# EAGLE design pm10Control (EAGLE 9.6.2)

## Sheet 1 of 2
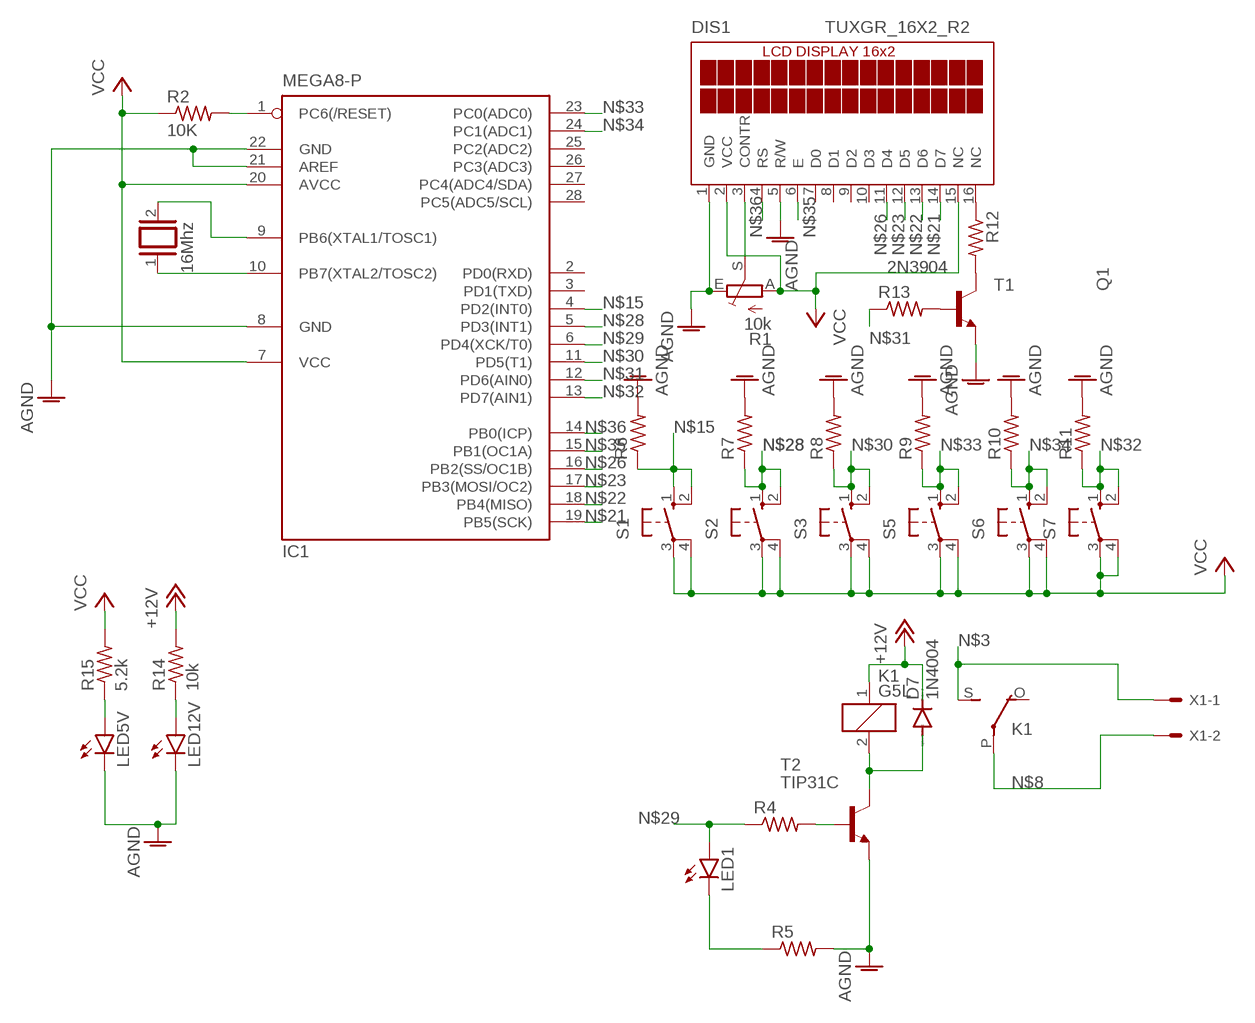
[diagram p0: schematic, sheet 1]

### Parts
D7  1N4004  [DO41-10]
DIS1  TUXGR_16X2_R2  [TUXGR_16X2_R2]
IC1  MEGA8-P  [DIL28-3]
K1  G5L  [G5LE]
LED1  LED3MM  [LED3MM]
LED5V  LED3MM  [LED3MM]
LED12V  LED3MM  [LED3MM]
Q1  16Mhz  XTAL/S  [QS]
R1  10k  TRIM_EU-B64Y  [B64Y]
R2  10K  R-US_0207/10  [0207/10]
R4  R-US_0207/10  [0207/10]
R5  R-US_0207/10  [0207/10]
R6  R-US_0207/10  [0207/10]
R7  R-US_0207/10  [0207/10]
R8  R-US_0207/10  [0207/10]
R9  R-US_0207/10  [0207/10]
R10  R-US_0207/10  [0207/10]
R11  R-US_0207/10  [0207/10]
R12  R-US_0207/10  [0207/10]
R13  R-US_0207/10  [0207/10]
R14  10k  R-US_0207/10  [0207/10]
R15  5.2k  R-US_0207/10  [0207/10]
S1  10-XX  [B3F-10XX]
S2  10-XX  [B3F-10XX]
S3  10-XX  [B3F-10XX]
S5  10-XX  [B3F-10XX]
S6  10-XX  [B3F-10XX]
S7  10-XX  [B3F-10XX]
T1  2N3904  [TO92]
T2  TIP31C  [TO220]
X1  KK-156-2  [KK-156-2]

### Nets
+12V: D7.C K1.1 R14.2 ; also sheet 2
AGND: DIS1.1(GND) DIS1.5(R/W) IC1.8(GND) IC1.21(AREF) IC1.22(GND) LED5V.K(C) LED12V.K(C) R1.E R5.2 R6.2 R7.2 R8.2 R9.2 R10.2 R11.2 T1.3(E) T2.3(E) ; also sheet 2
N$1: IC1.9(PB6(XTAL1/TOSC1)) Q1.2
N$2: IC1.10(PB7(XTAL2/TOSC2)) Q1.1
N$3: K1.S(2:S) X1.1
N$4: DIS1.16(NC) R12.1
N$5: R12.2 T1.1(C)
N$6: R13.2 T1.2(B)
N$7: IC1.1(PC6(/RESET)) R2.2
N$8: K1.P(2:P) X1.2
N$9: DIS1.3(CONTR) R1.S
N$11: LED5V.A R15.1
N$13: LED12V.A R14.1
N$15: IC1.4(PD2(INT0)) R6.1 S1.1(S) S1.2(S1)
N$21: DIS1.14(D7) IC1.19(PB5(SCK))
N$22: DIS1.13(D6) IC1.18(PB4(MISO))
N$23: DIS1.12(D5) IC1.17(PB3(MOSI/OC2))
N$24: D7.A K1.2 T2.2(C)
N$25: R4.2 T2.1(B)
N$26: DIS1.11(D4) IC1.16(PB2(SS/OC1B))
N$27: LED1.K(C) R5.1
N$28: IC1.5(PD3(INT1)) R7.1 S2.1(S) S2.2(S1)
N$29: IC1.6(PD4(XCK/T0)) LED1.A R4.1
N$30: IC1.11(PD5(T1)) R8.1 S3.1(S) S3.2(S1)
N$31: IC1.12(PD6(AIN0)) R13.1
N$32: IC1.13(PD7(AIN1)) R11.1 S7.1(S) S7.2(S1)
N$33: IC1.23(PC0(ADC0)) R9.1 S5.1(S) S5.2(S1)
N$34: IC1.24(PC1(ADC1)) R10.1 S6.1(S) S6.2(S1)
N$35: DIS1.6(E) IC1.15(PB1(OC1A))
N$36: DIS1.4(RS) IC1.14(PB0(ICP))
VCC: DIS1.2(VCC) DIS1.15(NC) IC1.7(VCC) IC1.20(AVCC) R1.A R2.1 R15.2 S1.3(P) S1.4(P1) S2.3(P) S2.4(P1) S3.3(P) S3.4(P1) S5.3(P) S5.4(P1) S6.3(P) S6.4(P1) S7.3(P) S7.4(P1) ; also sheet 2
Unconnected: DIS1.7(D0) DIS1.8(D1) DIS1.9(D2) DIS1.10(D3) IC1.2(PD0(RXD)) IC1.3(PD1(TXD)) IC1.25(PC2(ADC2)) IC1.26(PC3(ADC3)) IC1.27(PC4(ADC4/SDA)) IC1.28(PC5(ADC5/SCL)) K1.O(2:O)

## Sheet 2 of 2
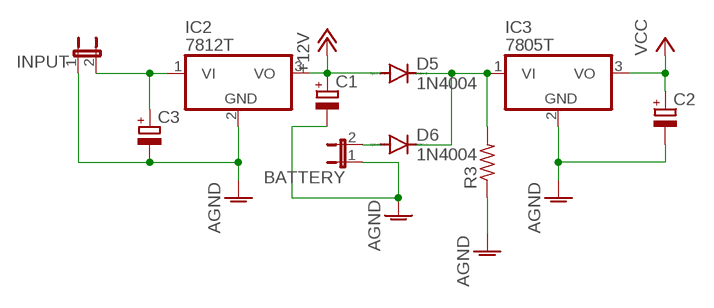
[diagram p1: schematic, sheet 2]

### Parts
BATTERY  JP1E  [JP1]
C1  CPOL-EUE5-10.5  [E5-10,5]
C2  CPOL-EUE5-10.5  [E5-10,5]
C3  CPOL-EUE5-10.5  [E5-10,5]
D5  1N4004  [DO41-10]
D6  1N4004  [DO41-10]
IC2  7812T  [TO220H]
IC3  7805T  [TO220H]
INPUT  JP1E  [JP1]
R3  R-US_0207/10  [0207/10]

### Nets
+12V: C1.+ D5.A IC2.3(VO) ; also sheet 1
AGND: BATTERY.1 C1.- C2.- C3.- IC2.2(GND) IC3.2(GND) INPUT.1 R3.1 ; also sheet 1
N$10: D5.C D6.C IC3.1(VI) R3.2
N$12: BATTERY.2 D6.A
N$16: C3.+ IC2.1(VI) INPUT.2
VCC: C2.+ IC3.3(VO) ; also sheet 1

## Library data of the parts
BATTERY INPUT = jumper:JP1E: JUMPER
C1-C3 = rcl:CPOL-EU: POLARIZED CAPACITOR, European symbol; SPICEPREFIX: C
D5-D7 = diode:1N4004: DIODE general purpose rectifier, 1 A
DIS1 = display-lcd:TUXGR_16X2_R2: Tuxgraphics LCD display 16x2 characters reflective, without background light Source: tuxgr_12x2_r2.pdf; OC_FARNELL: unknown; OC_NEWARK: unknown
IC1 = atmel:MEGA8-P: MICROCONTROLLER 8 Kbytes FLASH, 1 kbytes SRAM, 512 bytes EEPROM, USART, 4-channel 10 bit ADC, 2-channel 8 bit ADC Pin compatible with Atmega48, ATMega88, ATMega168 Source: avr.lbr; OC_FARNELL: unknown; OC_NEWARK: unknown
IC2 IC3 = linear:78*: Positive VOLTAGE REGULATOR Source: http://cache.national.com/ds/LM/LM78L05.pdf http://www.fairchildsemi.com/ds/LM/LM7805.pdf
K1 = relay:G5L: RELAY 1 x switch, 10 A/120 V AC, 8 A/30 V ADC, Omron; OC_FARNELL: unknown; OC_NEWARK: unknown
LED1 LED5V LED12V = led:LED: LED OSRAM: - CHIPLED LG R971, LG N971, LY N971, LG Q971, LY Q971, LO R971, LY R971 LH N974, LH R974 LS Q976, LO Q976, LY Q976 LO Q996 - Hyper CHIPLED LW Q18S LB Q993, LB Q99A, LB R99A - SideLED LS A670, LO A670, LY A670, LG A670, LP A670 LB A673, LV A673, LT A673, LW A673 LH A674 LY A675 LS A676, LA A676, LO A676, LY A676, LW A676 LS A679, LY A679, LG A679 - Hyper Micro SIDELED® LS Y876, LA Y876, LO Y876, LY Y876 LT Y87S - SmartLED LW L88C, LW L88S LB L89C, LB L89S, LG L890 LS L89K, LO L89K, LY L89K LS L896, LA L896, LO L896, LY L896 - TOPLED LS T670, LO T670, LY T670, LG T670, LP T670 LSG T670, LSP T670, LSY T670, LOP T670, LYG T670 LG T671, LOG T671, LSG T671 LB T673, LV T673, LT T673, LW T673 LH T674 LS T676, LA T676, LO T676, LY T676, LB T676, LH T676, LSB T676, LW T676 LB T67C, LV T67C, LT T67C, LS T67K, LO T67K, LY T67K, LW E67C LS E67B, LA E67B, LO E67B, LY E67B, LB E67C, LV E67C, LT E67C LW T67C LS T679, LY T679, LG T679 LS T770, LO T770, LY T770, LG T770, LP T770 LB T773, LV T773, LT T773, LW T773 LH T774 LS E675, LA E675, LY E675, LS T675 LS T776, LA T776, LO T776, LY T776, LB T776 LHGB T686 LT T68C, LB T68C - Hyper Mini TOPLED® LB M676 - Mini TOPLED Santana® LG M470 LS M47K, LO M47K, LY M47K Source: http://www.osram.convergy.de LUXEON: - LUMILED® LXK2-PW12-R00, LXK2-PW12-S00, LXK2-PW14-U00, LXK2-PW14-V00 LXK2-PM12-R00, LXK2-PM12-S00, LXK2-PM14-U00 LXK2-PE12-Q00, LXK2-PE12-R00, LXK2-PE12-S00, LXK2-PE14-T00, LXK2-PE14-U00 LXK2-PB12-K00, LXK2-PB12-L00, LXK2-PB12-M00, LXK2-PB14-N00, LXK2-PB14-P00, LXK2-PB14-Q00 LXK2-PR12-L00, LXK2-PR12-M00, LXK2-PR14-Q00, LXK2-PR14-R00 LXK2-PD12-Q00, LXK2-PD12-R00, LXK2-PD12-S00 LXK2-PH12-R00, LXK2-PH12-S00 LXK2-PL12-P00, LXK2-PL12-Q00, LXK2-PL12-R00 Source: www.luxeon.com KINGBRIGHT: KA-3528ASYC Source: www.kingbright.com
Q1 = special:XTAL/S: CRYSTAL
R1 = pot:TRIM_EU-: POTENTIOMETER
R2-R15 = rcl:R-US_: RESISTOR, American symbol; SPICEPREFIX: R
S1-S3 S5-S7 = switch-omron:10-XX: OMRON SWITCH; MPN: B3F-1000; OC_FARNELL: 176432; OC_NEWARK: 36M3542
T1 = transistor:2N3904: NPN TRANSISTOR
T2 = transistor-neu-to92:TIP31C: NPN TRANSISTOR
X1 = con-molex:KK-156-2: KK 156 HEADER Source: http://www.molex.com/pdm_docs/sd/026604100_sd.pdf; MF: MOLEX; OC_FARNELL: unknown; OC_NEWARK: unknown

## Board
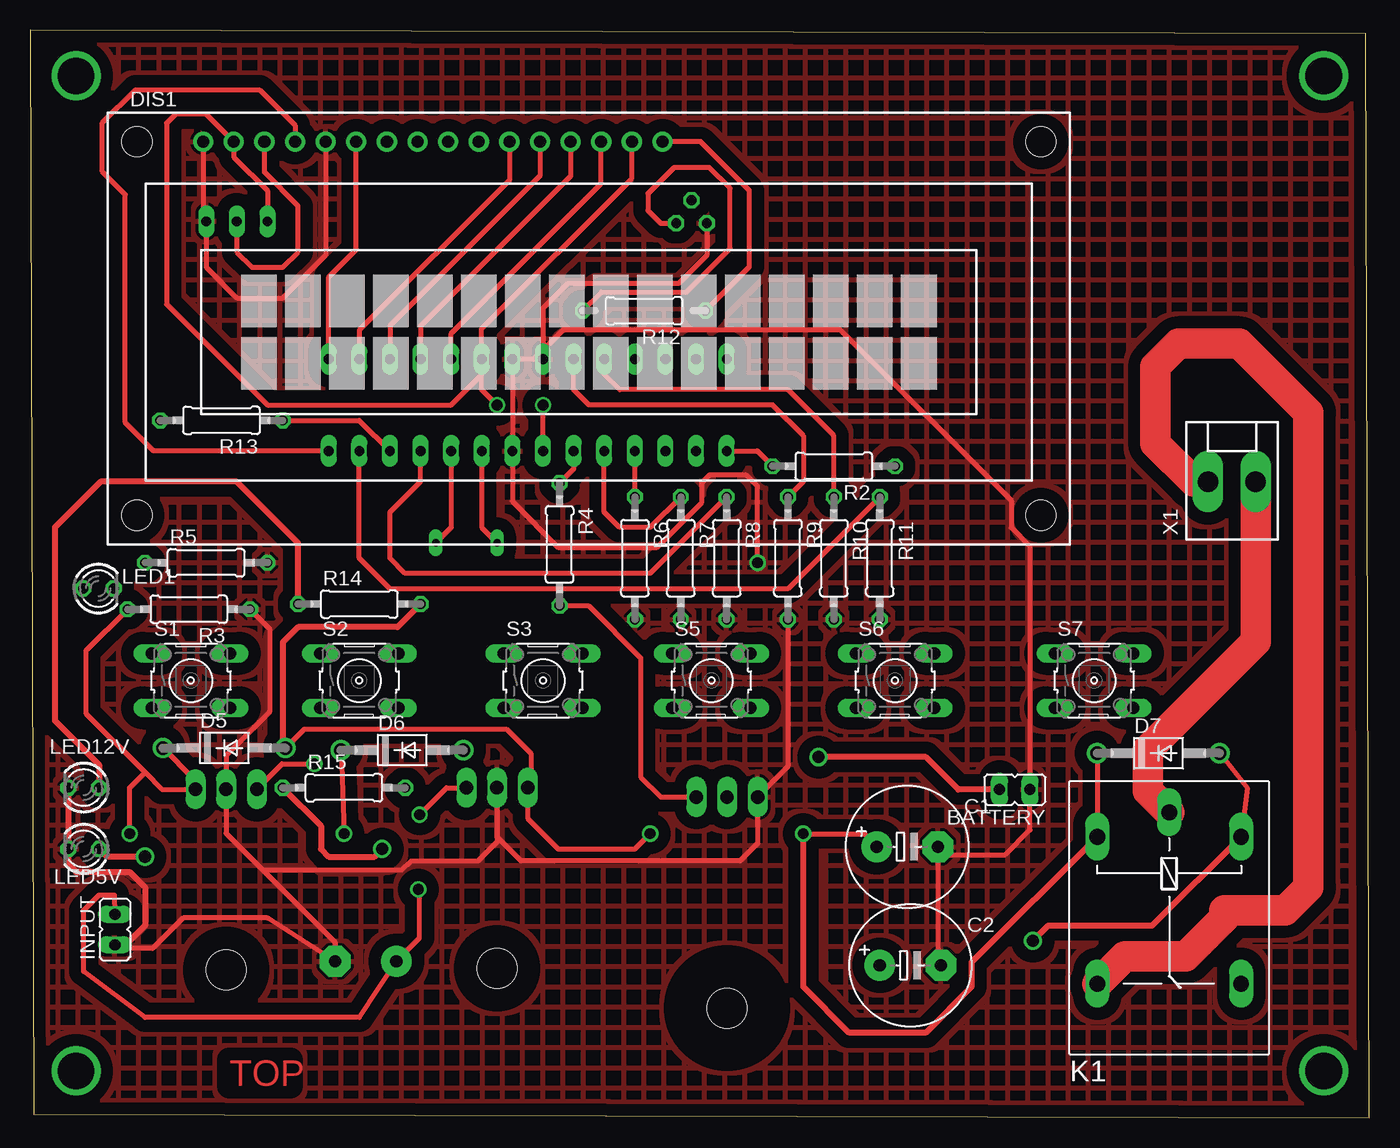
[diagram p2: board, top side]
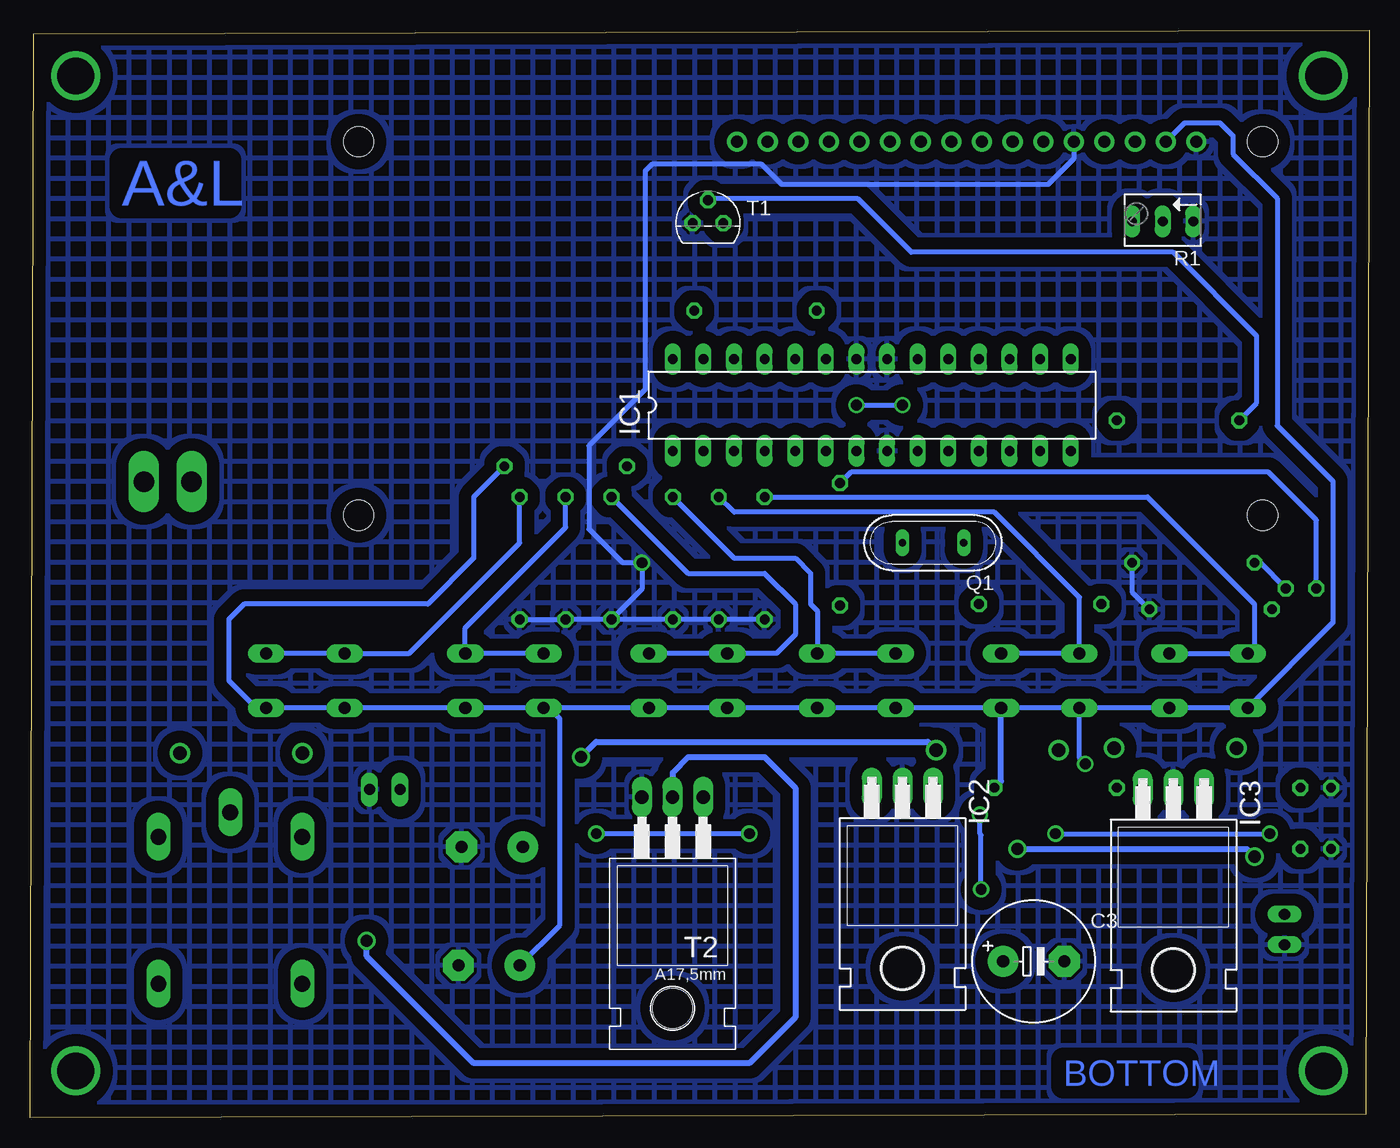
[diagram p3: board, bottom side, seen from below]

Size 111.1 x 90.24 mm. Coordinates in mm from the lower left corner, seen from the top.
Outline: 0.3,0.28 111.1,0 110.8,89.96 0,90.24 0.3,0.28
Copper layers (1*16): Top 0.035mm / dielectric 1.5mm / Bottom 0.035mm
Design rules "default": minimum track width 6mil, minimum drill 0.35mm, track to track 6mil, track to pad 6mil, pad to pad 6mil, via to via 6mil, smd to smd 6mil, copper to edge 40mil, drill to drill 6mil, minimum pad ring 10mil, minimum via ring 8mil, stop-mask expansion 4mil, vias tented up to drill 0mil, thermal gap 10mil

### Footprints (pad centres in the part's own frame; a part is rotated, then mirrored left to right if it is on the bottom)
JP1 = drill 0.914 long: 1 0,-1.27; 2 0,1.27
E5-10,5 = drill 1.016 pad 2.54: + -2.54,0 | drill 1.016 pad 2.54 octagon: - 2.54,0
DO41-10 = drill 1.118: A 5.08,0; C -5.08,0
TUXGR_16X2_R2 = drill 1 pad 1.676: 1 -32,15.5; 2 -29.46,15.5; 3 -26.92,15.5; 4 -24.38,15.5; 5 -21.84,15.5; 6 -19.3,15.5; 7 -16.76,15.5; 8 -14.22,15.5; 9 -11.68,15.5; 10 -9.14,15.5; 11 -6.6,15.5; 12 -4.06,15.5; 13 -1.52,15.5; 14 1.02,15.5; 15 3.56,15.5; 16 6.1,15.5 | hole 2.5: -37.5,-15.5; 37.5,-15.5; -37.5,15.5; 37.5,15.5
DIL28-3 = drill 0.813 long: 1 -16.51,-3.81; 2 -13.97,-3.81; 3 -11.43,-3.81; 4 -8.89,-3.81; 5 -6.35,-3.81; 6 -3.81,-3.81; 7 -1.27,-3.81; 8 1.27,-3.81; 9 3.81,-3.81; 10 6.35,-3.81; 11 8.89,-3.81; 12 11.43,-3.81; 13 13.97,-3.81; 14 16.51,-3.81; 15 16.51,3.81; 16 13.97,3.81; 17 11.43,3.81; 18 8.89,3.81; 19 6.35,3.81; 20 3.81,3.81; 21 1.27,3.81; 22 -1.27,3.81; 23 -3.81,3.81; 24 -6.35,3.81; 25 -8.89,3.81; 26 -11.43,3.81; 27 -13.97,3.81; 28 -16.51,3.81
TO220H = drill 1.118 long: 1 -2.54,-10.16; 2 0,-10.16; 3 2.54,-10.16 | hole 3.302: 0,4.826
G5LE = drill 1.321 long: 1 -7.493,-5.969; 2 -7.493,5.969; O 4.699,5.969; P -9.525,0; S 4.699,-5.969
LED3MM = drill 0.813 octagon: A -1.27,0; K 1.27,0
QS = drill 0.61 long: 1 -2.54,0; 2 2.54,0
B64Y = drill 0.813 long: A 2.54,0; E -2.54,0; S 0,0
0207/10 = drill 0.813 octagon: 1 -5.08,0; 2 5.08,0
B3F-10XX = drill 1.016 long: 1 -3.251,2.261; 2 3.251,2.261; 3 -3.251,-2.261; 4 3.251,-2.261
TO92 = drill 0.813 octagon: 1 1.27,0; 2 0,1.905; 3 -1.27,0
TO220 = drill 1.118 long: 1 -2.54,-6.35; 2 0,-6.35; 3 2.54,-6.35 | hole 3.302: 0,11.176
KK-156-2 = drill 1.7 pad 2.184 long: 1 -1.98,0; 2 1.98,0

### Placement (x,y rotation side)
BATTERY  81.69,27.23 90 top
C1  72.77,22.48 0 top
C2  73.03,12.65 0 top
C3  27.84,12.98 0 bottom
D5  16.1,30.68 0 top
D6  30.86,30.51 0 top
D7  93.6,30.25 0 top
DIS1  46.35,65.48 0 top
IC1  41.27,59.13 0 bottom
IC2  38.73,17.22 180 bottom
IC3  16.26,17.09 180 bottom
INPUT  7.04,15.62 0 top
K1  94.49,15.82 270 top
LED1  5.66,43.92 0 top
LED5V  4.45,22.3 180 top
LED12V  4.45,27.38 180 top
Q1  36.2,47.7 180 bottom
R1  17.15,74.37 180 bottom
R2  66.68,54.05 180 top
R3  13.16,42.19 180 top
R4  43.92,47.57 270 top
R5  14.61,46.05 0 top
R6  50.16,46.43 270 top
R7  53.98,46.43 270 top
R8  57.78,46.43 270 top
R9  62.86,46.43 270 top
R10  66.68,46.43 270 top
R11  70.48,46.43 270 top
R12  50.93,66.95 180 top
R13  15.88,57.86 180 top
R14  27.31,42.62 0 top
R15  26.04,27.38 0 top
S1  13.33,36.27 0 top
S2  27.31,36.27 0 top
S3  42.54,36.27 0 top
S5  56.52,36.27 0 top
S6  71.76,36.27 0 top
S7  88.27,36.27 0 top
T1  54.86,74.22 0 bottom
T2  57.81,20.27 180 bottom
X1  99.7,52.78 0 top

### Tracks (layer width: path | path; a pad name or v marks a point on that pad's centre or on a via)
+12V  (via drill 0.9)
  Top 0.406: D5.A 21.32,30.82 22.76,32.26 39.52,32.26 41.55,30.23 41.55,27.66 IC2.3 41.27,24.84 43.81,22.3 50.16,22.3 v51.43,23.57 | D7.C K1.1 | v64.14,23.57 69.22,23.57 C1.+
  Top 0.508: K1.1 78.11,12.9 78.11,10.87 74.3,7.06 67.95,7.06 64.14,10.87 v64.14,23.57 | R14.2 30.48,40.72 22.23,40.72 20.96,39.45 20.96,31.19 21.32,30.82
  Bottom 0.406: v51.43,23.57 v64.14,23.57
AGND  (via drill 0.9)
  Top 0.406: 41.78,62.94 IC1.22 42.54,67.16 44.6,69.22 53.8,69.22 56.13,71.55 T1.3 | 41.78,62.94 IC1.21 IC1.8 40,51.13 43.81,47.32 51.99,47.32 55.73,51.05 55.73,52.71 56.39,53.37 59.38,53.37 60.3,52.45 60.3,46.05 v60.35,46.05 | DIS1.1 14.36,74.62 R1.E 14.61,70.56 17.15,68.02 20.96,68.02 24.52,71.58 DIS1.5 | R9.2 62.86,29.13 T2.3 60.35,22.76 58.9,21.31 40.72,21.31 38.73,23.29 IC2.2 38.73,22.89 37.16,21.31 31.6,21.31 30.84,20.55 19.3,20.55 | 19.3,20.55 16.26,23.6 IC3.2 16.26,30.05 19.86,33.66 19.86,40.56 R3.1 | 41.78,62.94 44.25,65.41 67.18,65.41 81.39,51.2 81.39,48.96 82.96,47.39 BATTERY.1 82.96,23.88 80.9,21.82 75.97,21.82 C1.- 75.31,12.9 C2.- | 19.3,20.55 25.3,14.55 C3.- 19.69,16.59 12.7,16.59 10.16,14.05 6.98,14.05 INPUT.1
  Top 0.508: INPUT.1 7.92,14.35 9.53,15.95 9.53,19.13 8.26,20.4 3.81,20.4 3.17,21.03 LED5V.K LED12V.K
  Bottom 0.406: R11.2 R10.2 R9.2 | R9.2 R8.2 R7.2 R6.2 | R9.2 60.35,43.87 v60.35,46.05 61.95,46.05 64.75,48.84 64.75,55.75 60.07,60.43 60.07,78.54 59.51,79.1 50.42,79.1 48.74,77.42 26.67,77.42 24.52,79.57 DIS1.5 | R5.2 19.69,43.64 R3.1
  pour Top (isolate 1.016, hatched): 0,90.25 110.49,90.25 110.49,0.08 108.59,0.08 0,0.08
  pour Bottom (isolate 1.016, hatched): 0.64,89.61 109.86,89.61 109.86,61.67 109.86,1.35 0.64,1.35 0.64,1.98
N$1
  Top 0.406: IC1.9 37.46,48.97 Q1.2
N$2
  Top 0.406: IC1.10 34.92,48.97 Q1.1
N$3
  Top 2.54: K1.S 90.81,13.41 95.89,13.41 99.06,16.59 99.06,17.22 104.14,17.22 106.05,19.13 106.05,58.5 100.33,64.21 95.25,64.21 93.34,62.31 93.34,55.96 96.52,52.78 X1.1
N$4
  Top 0.406: R12.1 59.66,70.61 59.66,76.94 55.62,80.98 DIS1.16
N$5
  Top 0.406: R12.2 47.4,68.5 54.46,68.5 58.06,72.11 58.06,77.11 56.34,78.84 53.42,78.84 51.26,76.68 51.26,75.26 52.3,74.22 T1.1
N$6
  Bottom 0.406: R13.2 9.35,59.31 9.35,64.87 16.28,71.81 38,71.81 42.44,76.25 54.74,76.25 T1.2
N$7
  Top 0.406: IC1.1 60.32,55.32 R2.2
N$8
  Top 2.54: X1.2 101.68,39.52 92.71,30.56 92.71,27.13 K1.P
N$9
  Top 0.406: DIS1.3 19.44,78.43 22.23,75.64 22.23,71.83 20.96,70.56 18.42,70.56 17.15,71.83 R1.S
N$10  (via drill 0.9)
  Top 0.406: R3.2 4.62,38.74 4.62,33.55 9.53,28.65 | 13.54,27.25 10.92,27.25 9.53,28.65 | 13.54,27.25 IC3.1 | D5.C 13.54,28.17 13.54,27.25 | D6.C v26.04,23.57 | v8.26,23.57 8.26,27.38 9.53,28.65
  Bottom 0.406: v26.04,23.57 v8.26,23.57
N$11  (via drill 1)
  Top 0.508: R15.1 24.13,24.21 24.13,22.3 24.77,21.67 28.58,21.67 v29.21,22.3 | v9.53,21.67 6.35,21.67 LED5V.A
  Bottom 0.508: v29.21,22.3 10.16,22.3 v9.53,21.67
N$12  (via drill 1)
  Top 0.508: BATTERY.2 76.99,27.23 74.3,29.92 v65.41,29.92
  Bottom 0.508: v65.41,29.92 64.14,31.19 36.63,31.19 D6.A
N$13
  Top 0.508: R14.1 22.23,47.7 17.15,52.78 5.85,52.78 2.04,48.97 2.04,32.96 5.71,29.29 LED12V.A
N$14  (via drill 3.05)
  other vias: 3.81,86.44
N$15
  Top 0.406: R6.1 IC1.4
  Bottom 0.406: S1.2 S1.1 9.53,38.53 | 9.25,38.53 9.53,38.53 | R6.1 18.42,51.51 9.53,42.62 9.53,38.53
N$16  (via drill 0.9)
  Top 0.406: v32.21,18.95 32.31,18.85 32.31,14.91 C3.+ 27.31,8.33 9.53,8.33 4.45,12.14 4.45,17.22 5.71,18.49 6.98,18.49 INPUT.2 | v32.31,25.15 34.54,27.38 IC2.1
  Bottom 0.406: v32.21,18.95 32.21,23.47 32.31,23.57 v32.31,25.15
N$17  (via drill 3.05)
  other vias: 107.32,86.44
N$18  (via drill 3.05)
  other vias: 3.81,3.89
N$19  (via drill 3.05)
  other vias: 107.32,3.89
N$21
  Top 0.406: IC1.19 34.92,65.05 47.38,77.5 DIS1.14
N$22
  Top 0.406: DIS1.13 44.84,78.13 32.38,65.68 IC1.18
N$23
  Top 0.406: DIS1.12 42.29,78.16 29.85,65.71 IC1.17
N$24  (via drill 1)
  Top 0.406: D7.A 100.97,27.38 K1.2
  Top 0.508: K1.2 93.09,15.95 84.45,15.95 v83.19,14.68
  Bottom 0.508: T2.2 57.78,26.64 57.78,28.65 56.52,29.92 50.16,29.92 47.62,27.38 47.62,8.33 51.43,4.52 74.3,4.52 83.19,13.41 v83.19,14.68
N$25
  Top 0.406: R4.2 46.3,42.49 50.65,38.15 50.65,28.3 52.32,26.62 T2.1
N$26
  Top 0.406: DIS1.11 39.75,77.78 27.31,65.33 IC1.16
N$27
  Bottom 0.406: LED1.K 9.07,46.05 R5.1
N$28
  Top 0.406: R7.1 51.43,48.97 48.89,48.97 47.62,50.24 IC1.5
  Bottom 0.406: S2.2 S2.1 24.05,43.18 31.12,50.24 52.7,50.24 R7.1
N$29
  Top 0.406: IC1.6 45.09,53.82 R4.1
  Bottom 0.406: LED1.A 4.39,49.58 8.38,53.57 43,53.57 R4.1
N$30
  Top 0.406: R8.1 51.43,45.16 31.12,45.16 29.85,46.43 29.85,50.24 32.38,52.78 IC1.11
  Bottom 0.406: S3.1 S3.2 45.8,42.06 46.35,42.62 46.35,45.16 47.62,46.43 52.7,46.43 R8.1
N$31
  Top 0.406: R13.1 27.31,57.86 IC1.12
N$32
  Top 0.406: R11.1 62.86,43.89 29.85,43.89 27.31,46.43 IC1.13
  Bottom 0.406: S7.2 S7.1 79.65,38.53 70.48,47.7 R11.1
N$33
  Top 0.406: R9.1 64.14,52.78 64.14,56.59 61.59,59.13 46.35,59.13 45.09,60.4 IC1.23
  Bottom 0.406: S5.2 S5.1 49.17,38.53 47.62,40.08 47.62,42.62 50.16,45.16 56.52,45.16 R9.1
N$34
  Top 0.406: R10.1 66.68,56.59 62.86,60.4 48.89,60.4 47.62,61.67 IC1.24
  Bottom 0.406: S6.1 S6.2 75.01,40.64 66.68,48.97 R10.1
N$35
  Top 0.406: IC1.15 24.77,69.75 27.06,72.04 DIS1.6
N$36
  Top 0.406: IC1.14 10.24,55.32 7.9,57.66 7.9,76.61 5.99,78.51 5.99,82.55 8.74,85.29 19.03,85.29 21.98,82.34 DIS1.4
VCC  (via drill 0.9)
  Top 0.406: R1.A 19.69,76.91 16.9,79.7 DIS1.2 14.62,83.26 12.06,83.26 11.32,82.52 11.32,67.49 19.69,59.13 34.92,59.13 37.46,61.67 IC1.20 | IC1.7 v42.54,59.13 | v38.73,59.13 37.46,60.4 IC1.20 | IC1.20 37.46,65.48 49.91,77.93 DIS1.15 | IC3.3 20.9,29.36 v23.57,29.36
  Bottom 0.406: S2.3 S2.4 S3.3 S3.4 S5.3 S5.4 68.07,34.01 | 68.07,34.01 S6.3 S6.4 S7.3 S7.4 91.8,33.73 92.08,33.73 94.62,36.27 94.62,41.35 93.34,42.62 78.11,42.62 74.3,46.43 74.3,51.51 R2.1 | S2.3 S1.4 S1.3 3.02,41.07 3.02,52.81 7.64,57.43 7.64,76.28 11.32,79.96 11.32,81.48 12.39,82.55 15.33,82.55 DIS1.2 | v42.54,59.13 v38.73,59.13 | v23.57,29.36 24.05,29.85 S2.3 | C2.+ 67.16,15.98 67.16,33.1 68.07,34.01
  Bottom 0.508: R15.2 30.56,27.94 S2.4

### Text on the board
Top: TOP
Bottom: A&L | BOTTOM